# Altium schematic sheet Mini-DIN6 Breakout.SchDoc
size 127 x 76 mm; Address4: USA; DocumentNumber: 1; SheetNumber: 1; SheetTotal: 1
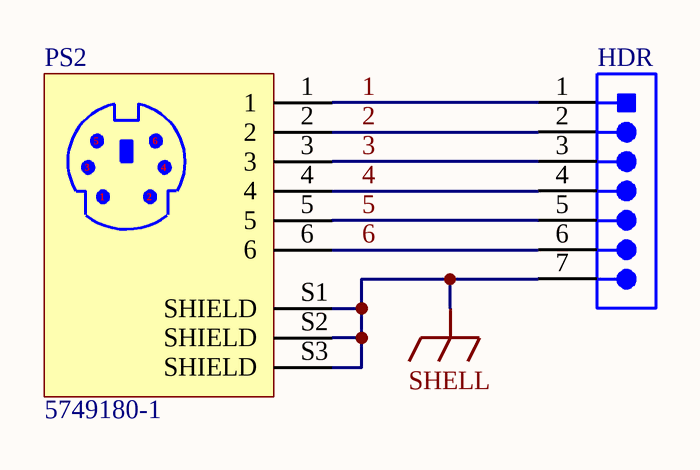
[diagram p0: Mini-DIN6 Breakout.SchDoc]

## Parts
HDR  7 contacts Male header  [PH1-07-UA]  (value not drawn)
PS2  Mini DIN-6  [5749180-1]  (value not drawn)

## Nets
SHELL: HDR.7 PS2.S1(SHIELD) PS2.S2(SHIELD) PS2.S3(SHIELD)
1: HDR.1 PS2.1
2: HDR.2 PS2.2
3: HDR.3 PS2.3
4: HDR.4 PS2.4
5: HDR.5 PS2.5
6: HDR.6 PS2.6

## Notes on the sheet
- Title:
- Desc:
- Size:
- Date:
- File:
- Repo:
- 3x5in Card
- Auth:
- Time:
- Sheet
- Proj:
- of

## Library data of the parts
HDR = PH1-07-UA: Connector Male Header 1X7 7contacts 0.100in pitch Gold Flash; Manufacturer: Adam Tech; PCB Package: 1x7 THT; Description in Visual: Con Hdr Male 7contacts vertical 1x7; Number of Contacts: 7; P/N: PH1-07-UA; Manufacturer P/N: PH1-07-UA; Orientation: vertical; Number of Rows: 1; Pitch: 0.100in; Contact Finish: Gold; Gender: Male; ComponentLink1Description: Manufacturer Website; ComponentLink1URL: http://www.adam-tech.com/; ComponentLink2Description: Component Datasheet; ComponentLink2URL: http://www.adam-tech.com/downloader.php?p=PH1-XX-UA.pdf; ComponentLink3Description: Octopart Link; ComponentLink3URL: https://octopart.com/ph1-06-ua-adam+tech-7873156?r=sp; Supplier 1: Digi-Key; Supplier Part Number 1: 2057-PH1-07-UA-ND; Supplier Part Number 2: 732-5320-ND; Supplier 2: Digi-Key
PS2 = 5749180-1: 6 Position Circular Connector Receptacle, Female Sockets Solder, Mini-DIN 6; Manufacturer: Tyco Electronics; Description in Visual: CONN RCPT FMALE MINI DIN 6P SLDR; Number of Contacts: 6; Gender: Socket; Polarization: Y; Connector Mount: PCB Mount, Right Angle; Finish: Gold; P/N: 5749180-1; Manufacturer P/N: 5749180-1; PCB Package: 5749180-1; Shell Size: Mini-Din; Material: Thermoplastic with Shield; Supplier 1: Digi-Key; Supplier Part Number 1: 5749180-1-ND